# EAGLE design EMS esp32 wifi v2.5 (EAGLE 9.5.2)
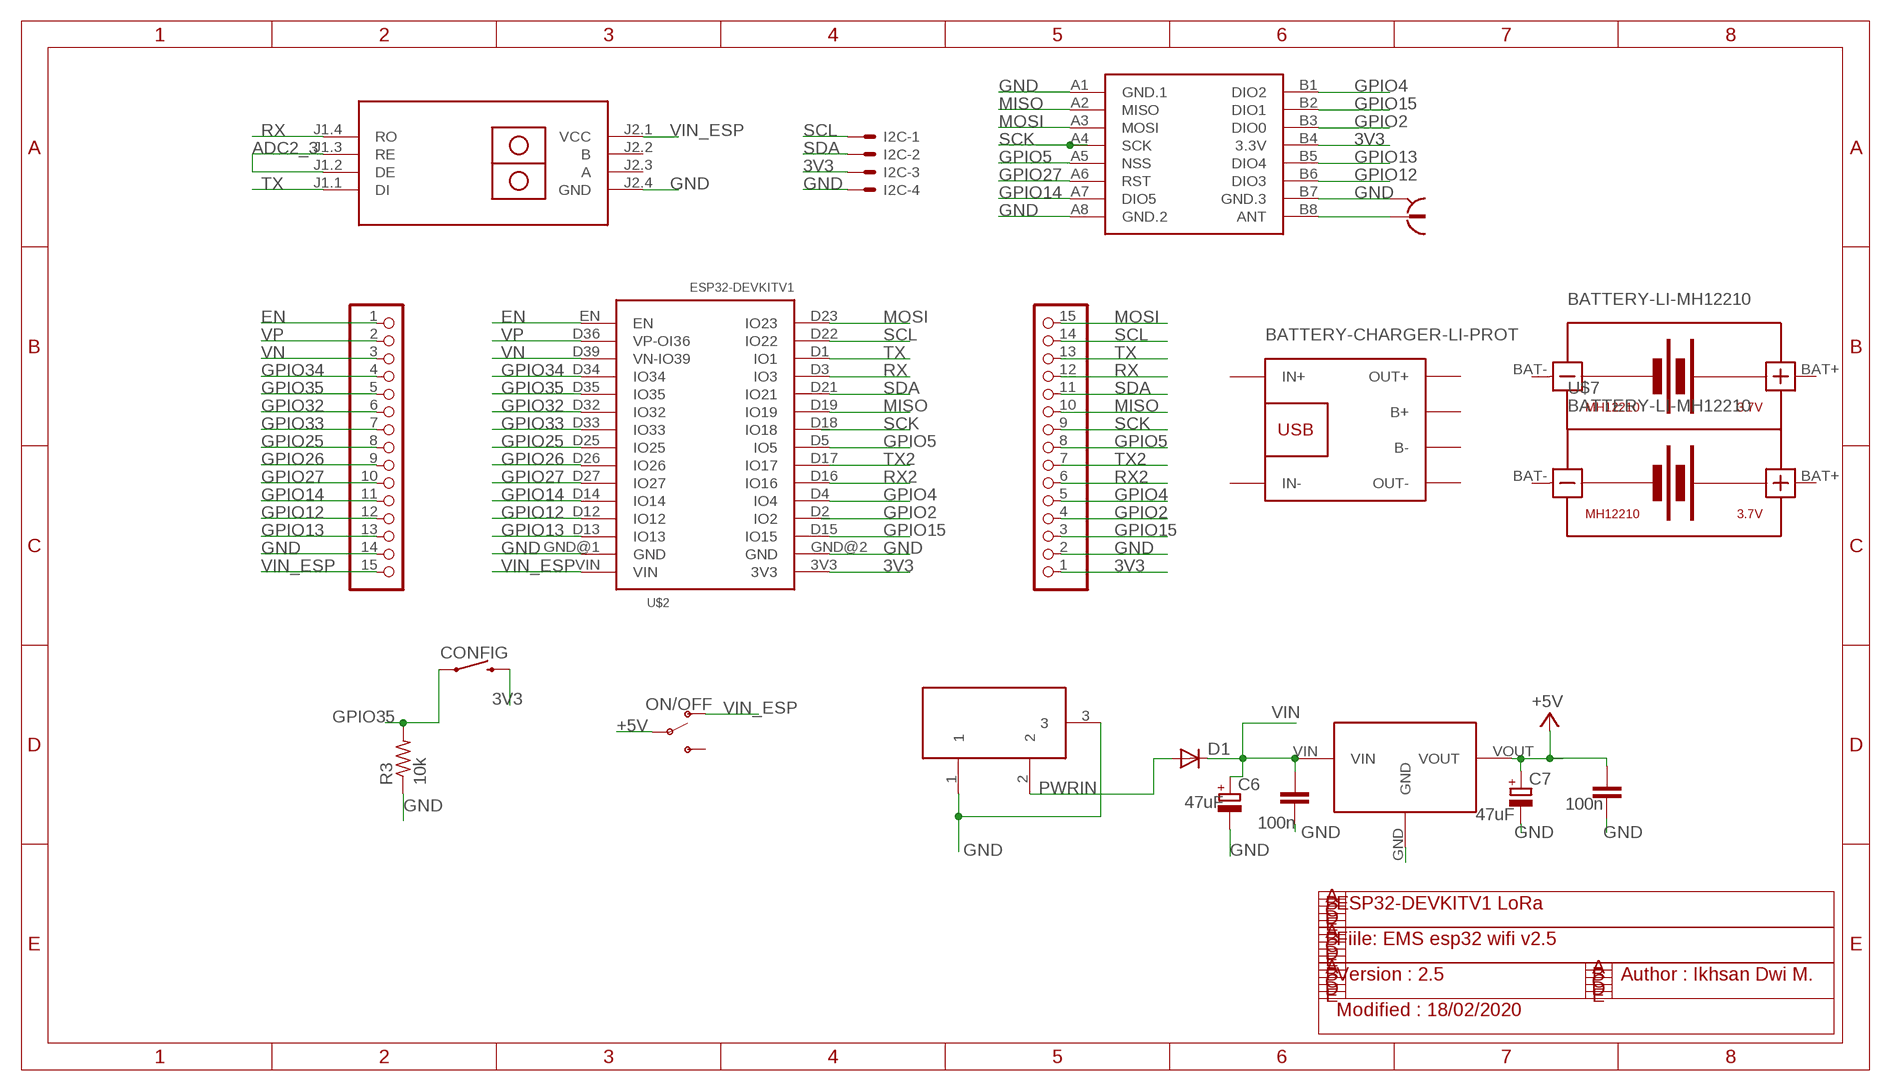
[diagram p0: schematic, sheet 1]

## Parts
C5  100n  C-EUC1206  [C1206]
C6  47uF  CPOL-EUD  [PANASONIC_D]
C7  47uF  CPOL-EUD  [PANASONIC_D]
C14  100n  C-EUC1206  [C1206]
CONFIG  MOMENTARY-SWITCH-SPST-PTH-6.0MM  [TACTILE_SWITCH_PTH_6.0MM]
D1  DIODE-SMB  [SMB]
I2C  22-23-2041  [22-23-2041]
JP1  PINHD-1X15  [1X15]
JP2  PINHD-1X15  [1X15]
ON/OFF  SWITCH-SPDT-PTH-11.6X4.0MM  [SWITCH_SPDT_PTH_11.6X4.0MM]
R3  10k  R-US_0204/7  [0204/7]
U$1  RS485-TTL-CONVERTER  [RS485-TTL-CONVERTER]
U$2  ESP32DEVKITV1  [ESP32-DEVKITV1]
U$3  SMARTPRJ_POWERSUPPLY_DC21MMX  [SMARTPRJ_POWERSUPPLY_DC-21MM]
U$4  7805-TO263_7805  [7805-TO263_TO263]
U$5  WIRELESS-LORA-RFM95W#SMD  [WIRELESS-LORA-RFM95W#SMD]
U$6  BATTERY-LI-MH12210  [BATTERY-LI-MH12210]
U$7  BATTERY-LI-MH12210  [BATTERY-LI-MH12210]
U$8  BATTERY-CHARGER-LI-PROT  [BATTERY-CHARGER-LI-PROT]
X1  734120110  [734120110]

## Nets
3V3: CONFIG.3 I2C.3 JP2.1 U$2.3V3 U$5.B4(3.3V)
+5V [usbvcc]: C7.+ C14.2 ON/OFF.2(P) U$4.VOUT
ADC2_3: U$1.J1.2(DE) U$1.J1.3(RE)
EN: JP1.1 U$2.EN
GND: C5.1 C6.- C7.- C14.1 I2C.4 JP1.14 JP2.2 R3.1 U$1.J2.4(GND) U$2.GND@1(GND) U$2.GND@2(GND) U$3.1 U$3.3 U$4.GND U$5.A1(GND.1) U$5.A8(GND.2) U$5.B7(GND.3) X1.S@1 X1.S@2 X1.S@3
GPIO2: JP2.4 U$2.D2(IO2) U$5.B3(DIO0)
GPIO4: JP2.5 U$2.D4(IO4) U$5.B1(DIO2)
GPIO5: JP2.8 U$2.D5(IO5) U$5.A5(NSS)
GPIO12: JP1.12 U$2.D12(IO12) U$5.B6(DIO3)
GPIO13: JP1.13 U$2.D13(IO13) U$5.B5(DIO4)
GPIO14: JP1.11 U$2.D14(IO14) U$5.A7(DIO5)
GPIO15: JP2.3 U$2.D15(IO15) U$5.B2(DIO1)
GPIO25: JP1.8 U$2.D25(IO25)
GPIO26: JP1.9 U$2.D26(IO26)
GPIO27: JP1.10 U$2.D27(IO27) U$5.A6(RST)
GPIO32: JP1.6 U$2.D32(IO32)
GPIO33: JP1.7 U$2.D33(IO33)
GPIO34: JP1.4 U$2.D34(IO34)
GPIO35: CONFIG.1 JP1.5 R3.2 U$2.D35(IO35)
MISO: JP2.10 U$2.D19(IO19) U$5.A2(MISO)
MOSI: JP2.15 U$2.D23(IO23) U$5.A3(MOSI)
N$8: U$5.B8(ANT) X1.1
PWRIN [power]: D1.A U$3.2
RX: JP2.12 U$1.J1.4(RO) U$2.D3(IO3)
RX2: JP2.6 U$2.D16(IO16)
SCK: JP2.9 U$2.D18(IO18) U$5.A4(SCK)
SCL: I2C.1 JP2.14 U$2.D22(IO22)
SDA: I2C.2 JP2.11 U$2.D21(IO21)
TX: JP2.13 U$1.J1.1(DI) U$2.D1(IO1)
TX2: JP2.7 U$2.D17(IO17)
VIN: C5.2 C6.+ D1.C U$4.VIN
VIN_ESP [usbvcc]: JP1.15 ON/OFF.1(O) U$1.J2.1(VCC) U$2.VIN
VN: JP1.3 U$2.D39(VN-IO39)
VP: JP1.2 U$2.D36(VP-OI36)
Unconnected: ON/OFF.3(S) U$1.J2.2(B) U$1.J2.3(A) U$8.B+ U$8.B- U$8.IN+ U$8.IN- U$8.OUT+ U$8.OUT-

## Notes on the sheet
- ESP32-DEVKITV1 LoRa
- Fiile: EMS esp32 wifi v2.5
- Version : 2.5 | Author : Ikhsan Dwi M.
- Modified : 18/02/2020

## Power pins joined to a net without a drawn wire
BAT+: U$6.BAT+ U$7.BAT+
BAT-: U$6.BAT- U$7.BAT-

## Library data of the parts
C5 C14 = rcl:C-EU: CAPACITOR, European symbol
C6 C7 = rcl:CPOL-EU: POLARIZED CAPACITOR, European symbol
CONFIG = SparkFun-Switches:MOMENTARY-SWITCH-SPST: Momentary Switch (Pushbutton) - SPST Normally-open (NO) SPST momentary switches (buttons, pushbuttons). Variants PTH-12MM - 12mm square, through-hole Momentary Pushbutton Switch - 12mm Square <https://www.sparkfun.com/products/9190> (COM-09190) PTH-6.0MM, PTH-6.0MM-KIT - 6.0mm square, through-hole Mini Pushbutton Switch <https://www.sparkfun.com/products/97> (COM-00097) KIT package intended for soldering kit's - only one side of pads' copper is exposed. PTH-RIGHT-ANGLE-KIT - Right-angle, through-hole Right Angle Tactile Button <https://www.sparkfun.com/products/10791> - Used on SparkFun BigTime Watch Kit <https://www.sparkfun.com/products/11734> SMD-12MM - 12mm square, surface-mount Tactile Button - SMD (12mm) <https://www.sparkfun.com/products/12993> (COM-12993) Used on SparkFun PicoBoard <https://www.sparkfun.com/products/11888> SMD-4.5MM - 4.5mm Square Trackball Switch Used on SparkFun Blackberry Trackballer Breakout <https://www.sparkfun.com/products/13169> SMD-4.6MMX2.8MM - 4.60mm x 2.80mm, surface mount Used on SparkFun SAMD21 Mini Breakout <https://www.sparkfun.com/products/13664> SMD-5.2MM, SMD-5.2-REDUNDANT - 5.2mm square, surface-mount Mini Pushbutton Switch - SMD <https://www.sparkfun.com/products/8720> (COM-08720) Used on Arduino Pro Mini <https://www.sparkfun.com/products/11114> REDUNDANT package connects both switch circuits together SMD-6.0X3.5MM - 6.0 x 3.5mm, surface mount Momentary Reset Switch SMD <https://www.sparkfun.com/products/8229> (COM-08229) SMD-6.2MM-TALL - 6.2mm square, surface mount Tactile Button - SMD (6mm) <https://www.sparkfun.com/products/12992> Used on SparkFun Digital Sandbox <https://www.sparkfun.com/products/12651> SMD-RIGHT-ANGLE - Right-angle, surface mount Used on SparkFun Block for Intel® Edison - Arduino <https://www.sparkfun.com/products/13036>; PROD_ID: SWCH-08441; SF_SKU: COM-00097
D1 = diode:DIODE-: DIODE
I2C = con-molex:22-23-2041: .100" (2.54mm) Center Header - 4 Pin; MF: MOLEX; MPN: 22-23-2041; OC_FARNELL: 1462920; OC_NEWARK: 38C0355
JP1 JP2 = pinhead:PINHD-1X15: PIN HEADER
ON/OFF = SparkFun-Switches:SWITCH-SPDT: Single Pole, Double Throw (SPDT) Switch Single-pole, double-throw (SPDT) switch. Variant Overview SMD-AYZ0202 Surface Mount DPDT Switch <https://www.sparkfun.com/products/597> (COM-00597) Used on e.g. LilyPad Arduino USB - ATmega32U4 Board <https://www.sparkfun.com/products/12049> PTH-11.6X4.0MM SPDT Mini Power Switch <https://www.sparkfun.com/products/102> (COM-00102) Used on e.g. SparkFun Simon Says - Through-Hole Soldering Kit <https://www.sparkfun.com/products/10547> (KIT-10547) PTH-11.6X4.0MM-KIT KIT version of SPDT Mini Power Switch - Simplifies soldering by removing tStop of switch pins - only one side can be soldered. PTH-11.6X4.0MM-LOCK LOCK version of SPDT Mini Power Switch - Offset pins hold switch in place for easier soldering. SMD-RIGHT-ANGLE Surface Mount Right Angle Switch <https://www.sparkfun.com/products/10860> (COM-10860) Used on e.g. SparkFun ESP8266 Thing <https://www.sparkfun.com/products/13231>; PROD_ID: SWCH-08261; SF_SKU: COM-00102
R3 = rcl:R-US_: RESISTOR, American symbol; SPICEPREFIX: R
U$1 = diy-modules:RS485-TTL-CONVERTER: RS485 to TTL converter based on MAX485 chip
U$2 = ESP32-DEVKITV1:ESP32DEVKITV1
U$3 = arduino_Uno_Rev3-02-TH:SMARTPRJ_POWERSUPPLY_DC21MM
U$4 = arduino_f:7805-TO263_7805
U$5 = diy-modules:WIRELESS-LORA-RFM95W: 868/915 MHz LoRa Radio Transceiver Module based on SX1276 chip Click here to find device on ebay.com <http://www.ebay.com/sch/RFM95W+transceiver>
U$6 U$7 = diy-modules:BATTERY-LI-MH12210: Lithium-Ion MH12210 Rechargeable Battery Panasonic NCR18650PF battery datasheet available here: https://industrial.panasonic.com/cdbs/www-data/pdf2/ACI4000/ACI4000C12.pdf Click here to find device on ebay.com <http://www.ebay.com/sch/ncr18650b+battery>
U$8 = diy-modules:BATTERY-CHARGER-LI-PROT: Lithium Battery 5V Charger with protection circuit More details available here: http://www.instructables.com/id/DIY-Lithium-ion-Battery-Charger/step4/TP4056-based-lithium-ion-battery-charger-module/ Click here to find device on ebay.com <http://www.ebay.com/sch/tp4056+charger+usb+protection>
X1 = con-coax:734120110: MICRO COAXIAL CONNECTOR RECEPTACLE VERTICAL Source: Data sheet <http://www.molex.com/pdm_docs/sd/734120110_sd.pdf>

## Net classes
1 power: width 0.61 mm, drill 0.508 mm, clearance 0.152 mm
2 gnd: width 0.305 mm, drill 0.508 mm, clearance 0.152 mm
3 usbvcc: width 0.508 mm, drill 0.508 mm, clearance 0.152 mm

## Board
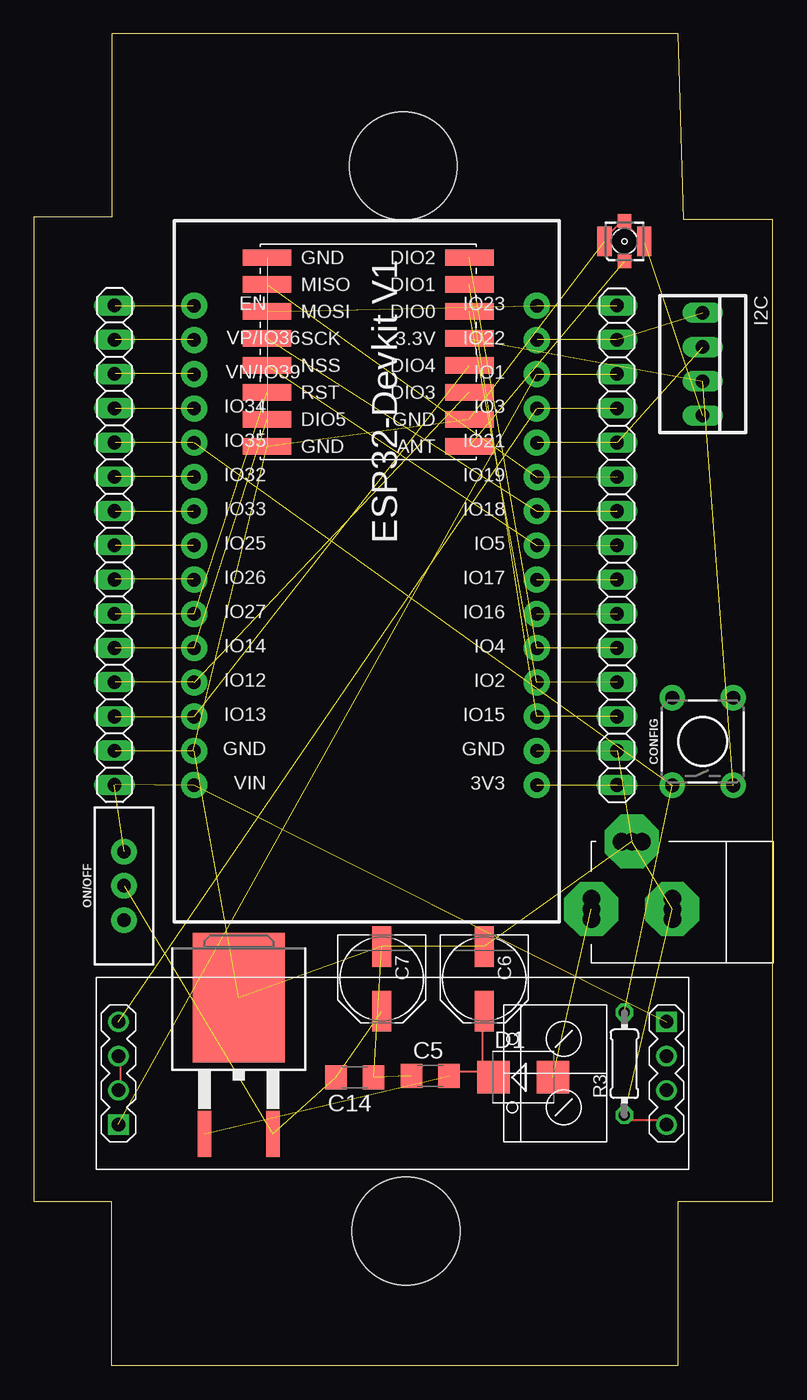
[diagram p1: board, top side]
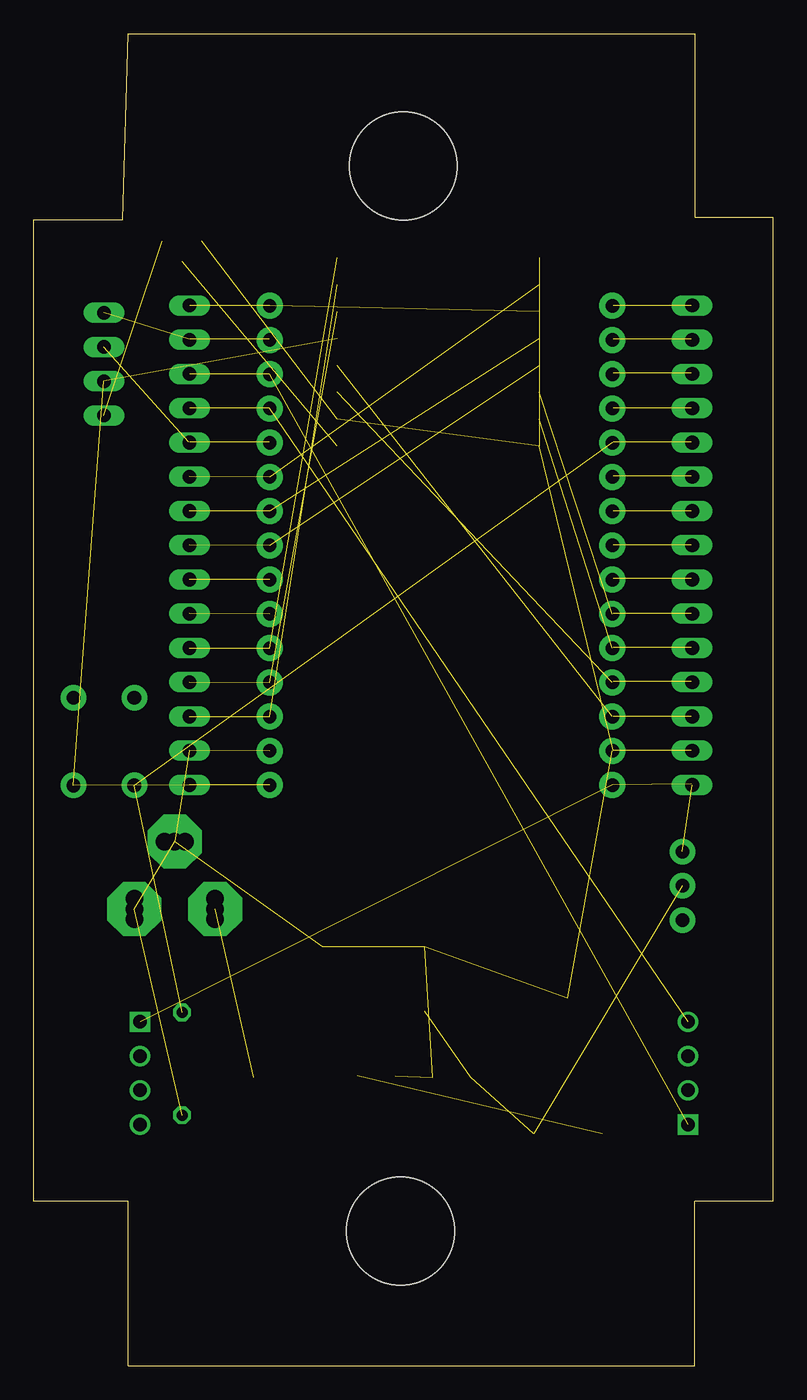
[diagram p2: board, bottom side, seen from below]

Size 54.8 x 98.8 mm. Coordinates in mm from the lower left corner, seen from the top.
Outline: 0,12.2 5.8,12.2 5.8,0 47.8,0 47.8,12.2 54.8,12.2 54.8,85 48.2,85 47.8,98.8 5.8,98.8 5.8,85.2 0,85.2 0,12.2
Copper layers (1*16): Top 0.035mm / dielectric 1.5mm / Bottom 0.035mm
Design rules "default": minimum track width 6mil, minimum drill 0.35mm, track to track 6mil, track to pad 6mil, pad to pad 6mil, via to via 6mil, smd to smd 6mil, copper to edge 40mil, drill to drill 6mil, minimum pad ring 10mil, minimum via ring 8mil, stop-mask expansion 4mil, vias tented up to drill 0mil, thermal gap 10mil
Holes 8 mm at 27.6,10 27.4,89

### Footprints (pad centres in the part's own frame; a part is rotated, then mirrored left to right if it is on the bottom)
C1206 = smd 1.6 x 1.8: 1 -1.4,0; 2 1.4,0
PANASONIC_D = smd 3 x 1.4: + 2.4,0; - -2.4,0
TACTILE_SWITCH_PTH_6.0MM = drill 1.016 pad 1.88: 1 -3.251,2.261; 2 3.251,2.261; 3 -3.251,-2.261; 4 3.251,-2.261
SMB = smd 2.4 x 2.4: A 2.2,0; C -2.2,0
22-23-2041 = drill 1 long: 1 -3.81,0; 2 -1.27,0; 3 1.27,0; 4 3.81,0
1X15 = drill 1.016 long: 1 -17.78,0; 2 -15.24,0; 3 -12.7,0; 4 -10.16,0; 5 -7.62,0; 6 -5.08,0; 7 -2.54,0; 8 0,0; 9 2.54,0; 10 5.08,0; 11 7.62,0; 12 10.16,0; 13 12.7,0; 14 15.24,0; 15 17.78,0
SWITCH_SPDT_PTH_11.6X4.0MM = drill 1.016 pad 1.88: 1 0,2.54; 2 0,0; 3 0,-2.54
0204/7 = drill 0.813 octagon: 1 -3.81,0; 2 3.81,0
RS485-TTL-CONVERTER = drill 1 square: J1.1 -20.32,-3.81; J2.1 20.32,3.81 | drill 1: J1.2 -20.32,-1.27; J1.3 -20.32,1.27; J1.4 -20.32,3.81; J2.2 20.32,1.27; J2.3 20.32,-1.27; J2.4 20.32,-3.81
ESP32-DEVKITV1 = drill 1 pad 1.93: 3V3 -16.52,-12.27; D1 13.96,-12.27; D2 -8.9,-12.27; D3 11.42,-12.27; D4 -6.36,-12.27; D5 1.26,-12.27; D12 -8.9,13.135; D13 -11.44,13.135; D14 -6.36,13.135; D15 -11.44,-12.27; D16 -3.82,-12.27; D17 -1.28,-12.27; D18 3.8,-12.27; D19 6.34,-12.27; D21 8.88,-12.27; D22 16.5,-12.27; D23 19.04,-12.27; D25 1.26,13.135; D26 -1.28,13.135; D27 -3.82,13.135; D32 6.34,13.135; D33 3.8,13.135; D34 11.42,13.135; D35 8.88,13.135; D36 16.5,13.135; D39 13.96,13.135; EN 19.04,13.135; GND@1 -13.98,13.135; GND@2 -13.98,-12.27; VIN -16.52,13.135
SMARTPRJ_POWERSUPPLY_DC-21MM = drill 1.3 pad 4 octagon: 1 -5.08,-3.353; 2 -0.076,-6.35; 3 -0.076,-0.356 | drill 1.3: 4 -5.08,-4.115; 5 -5.08,-2.591; 6 -0.838,-0.356; 7 0.686,-0.356; 8 -0.838,-6.35; 9 0.686,-6.35
7805-TO263_TO263 = smd 6.8 x 9.6: GND 0,3.5 | smd 1 x 3.4: VIN -2.54,-6.6; VOUT 2.54,-6.6
WIRELESS-LORA-RFM95W#SMD = smd 3.6 x 1.2: A1 -7.5,7; A2 -7.5,5; A3 -7.5,3; A4 -7.5,1; A5 -7.5,-1; A6 -7.5,-3; A7 -7.5,-5; A8 -7.5,-7; B1 7.5,7; B2 7.5,5; B3 7.5,3; B4 7.5,1; B5 7.5,-1; B6 7.5,-3; B7 7.5,-5; B8 7.5,-7
BATTERY-LI-MH12210 = drill 1.5 pad 3 square: BAT+ -33.02,0 | drill 1.5 pad 3: BAT- 33.02,0
BATTERY-CHARGER-LI-PROT = drill 1.2 pad 2.5 square: B+ 10.795,3.81; B- 10.795,-3.81; IN+ -12.065,6.985; IN- -12.065,-6.985; OUT+ 10.795,6.985; OUT- 10.795,-6.985
734120110 = smd 1 x 1: 1 0,-1.5; S@1 0,1.5 | smd 1.05 x 2.2: S@2 -1.475,0; S@3 1.475,0

### Placement (x,y rotation side)
C5  29.4,21.5 0 top
C6  33.4,28.7 270 top
C7  25.8,28.7 270 top
C14  23.8,21.4 180 top
CONFIG  49.6,46.3 90 top
D1  36.3,21.4 0 top
I2C  49.6,74.3 270 top
JP1  5.98,60.86 270 top
JP2  43.25,60.86 90 top
ON/OFF  6.7,35.6 0 top
R3  43.8,22.4 90 top
U$1  26.6,21.7 0 top
U$2  25.03,59.59 90 top
U$3  47.7,33.8 270 top
U$4  15.2,23.8 0 top
U$5  24.8,75.2 0 top
U$6  -1.4,-21.2 0 top  (outside the outline)
U$7  -1.4,-46.4 0 top  (outside the outline)
U$8  -21.2,-71 0 top  (outside the outline)
X1  43.8,83.4 0 top

### Tracks (layer width: path | path; a pad name or v marks a point on that pad's centre or on a via)
3V3  (4 unrouted)
  Top 0.152: 37.27,43.14 U$2.3V3
+5V  (3 unrouted)
ADC2_3
  Top 0.152: U$1.J1.2 6.4,20.7 6.4,22.7 U$1.J1.3
BAT+  (1 unrouted)
BAT-  (1 unrouted)
EN  (1 unrouted)
  Top 0.152: 6.03,78.65 JP1.1 | 11.82,78.65 U$2.EN
GND  (16 unrouted)
  Top 0.152: 6.03,45.65 JP1.14 | 11.82,45.65 U$2.GND@1 | X1.S@3 44.9,83.7 43.9,84.7 X1.S@1 43.4,84.7 42.4,83.7 X1.S@2 | R3.1 43.9,18.2 46.9,18.2 U$1.J2.4
  Bottom 0.152: 37.27,45.58 U$2.GND@2
GPIO2  (2 unrouted)
GPIO4  (2 unrouted)
GPIO5  (2 unrouted)
GPIO12  (2 unrouted)
  Top 0.152: 11.82,50.76 U$2.D12 | 6.03,50.76 JP1.12
GPIO13  (2 unrouted)
  Top 0.152: 11.82,48.17 U$2.D13 | 6.03,48.17 JP1.13
GPIO14  (2 unrouted)
  Top 0.152: 11.82,53.27 U$2.D14 | 6.03,53.27 JP1.11
GPIO15  (2 unrouted)
GPIO25  (1 unrouted)
  Top 0.152: 11.82,60.89 U$2.D25 | 6.03,60.89 JP1.8
GPIO26  (1 unrouted)
  Top 0.152: 11.82,58.38 U$2.D26 | 6.03,58.38 JP1.9
GPIO27  (2 unrouted)
  Top 0.152: 11.82,55.79 U$2.D27 | 6.03,55.79 JP1.10
GPIO32  (1 unrouted)
  Top 0.152: 11.82,66 U$2.D32 | 6.03,66 JP1.6
GPIO33  (1 unrouted)
  Top 0.152: 11.82,63.41 U$2.D33 | 6.03,63.41 JP1.7
GPIO34  (1 unrouted)
  Top 0.152: 11.82,71.03 U$2.D34 | 6.03,71.03 JP1.4
GPIO35  (3 unrouted)
  Top 0.152: 11.82,68.51 U$2.D35 | 6.03,68.51 JP1.5
MISO  (2 unrouted)
MOSI  (2 unrouted)
  Top 0.152: 43.22,78.65 JP2.15 | 37.35,78.65 U$2.D23
N$8  (1 unrouted)
PWRIN  (1 unrouted)
RX  (2 unrouted)
  Top 0.152: 37.35,71.03 U$2.D3 | 43.22,71.03 JP2.12
RX2  (1 unrouted)
SCK  (2 unrouted)
SCL  (2 unrouted)
  Top 0.152: 43.29,76.13 JP2.14 43.22,76.13 | 37.35,76.13 U$2.D22
SDA  (2 unrouted)
  Top 0.152: 37.35,68.51 U$2.D21 | 43.22,68.51 JP2.11
  Bottom 0.152: 43.29,68.51 JP2.11
TX  (2 unrouted)
  Top 0.152: 37.35,73.54 U$2.D1 | 43.22,73.54 JP2.13
TX2  (1 unrouted)
VIN  (1 unrouted)
  Top 0.152: 33.3,21.8 33.8,21.8 D1.C 33.3,21.8 | 33.3,21.8 30.8,21.8 C5.2 | 33.3,21.8 33.3,26.3 C6.+
VIN_ESP  (3 unrouted)
  Top 0.152: 6.03,43.14 JP1.15
VN  (1 unrouted)
  Top 0.152: 6.03,73.62 JP1.3 | 11.82,73.62 U$2.D39
VP  (1 unrouted)
  Top 0.152: 6.03,76.13 JP1.2 | 11.82,76.13 U$2.D36